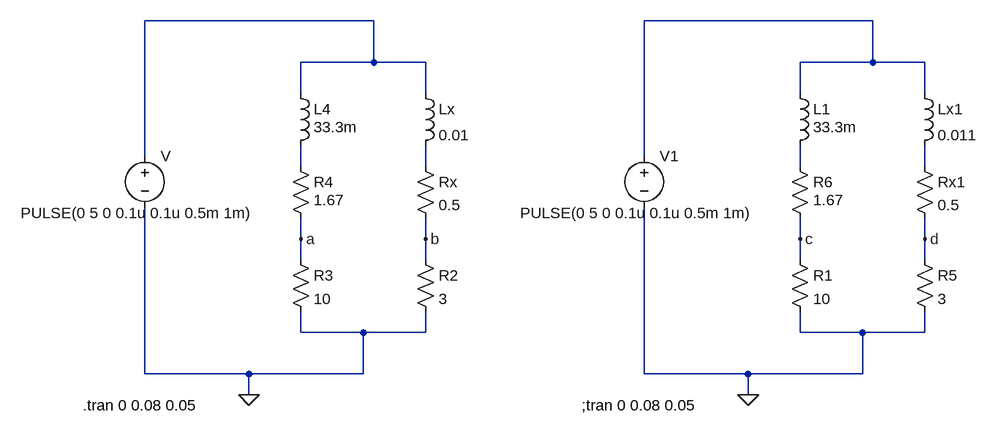
[diagram p0: schematic Maxwell_bridge.asc]
Maxwell_bridge.asc, the LTspice schematic file:
Version 4
SHEET 1 1288 680
WIRE 352 -64 0 -64
WIRE 1120 -64 768 -64
WIRE 352 0 352 -64
WIRE 352 0 240 0
WIRE 432 0 352 0
WIRE 1120 0 1120 -64
WIRE 1120 0 1008 0
WIRE 1200 0 1120 0
WIRE 240 48 240 0
WIRE 432 48 432 0
WIRE 1008 48 1008 0
WIRE 1200 48 1200 0
WIRE 0 144 0 -64
WIRE 768 144 768 -64
WIRE 240 160 240 128
WIRE 432 160 432 128
WIRE 1008 160 1008 128
WIRE 1200 160 1200 128
WIRE 240 272 240 240
WIRE 432 272 432 240
WIRE 1008 272 1008 240
WIRE 1200 272 1200 240
WIRE 240 304 240 272
WIRE 432 304 432 272
WIRE 1008 304 1008 272
WIRE 1200 304 1200 272
WIRE 240 416 240 384
WIRE 336 416 240 416
WIRE 432 416 432 384
WIRE 432 416 336 416
WIRE 1008 416 1008 384
WIRE 1104 416 1008 416
WIRE 1200 416 1200 384
WIRE 1200 416 1104 416
WIRE 0 480 0 224
WIRE 160 480 0 480
WIRE 336 480 336 416
WIRE 336 480 160 480
WIRE 768 480 768 224
WIRE 928 480 768 480
WIRE 1104 480 1104 416
WIRE 1104 480 928 480
WIRE 160 512 160 480
WIRE 928 512 928 480
FLAG 160 512 0
FLAG 240 272 a
FLAG 432 272 b
FLAG 928 512 0
FLAG 1008 272 c
FLAG 1200 272 d
SYMBOL voltage 0 128 R0
WINDOW 123 0 0 Left 0
WINDOW 39 0 0 Left 0
WINDOW 3 -191 104 Left 2
SYMATTR Value PULSE(0 5 0 0.1u 0.1u 0.5m 1m)
SYMATTR InstName V
SYMBOL res 224 288 R0
SYMATTR InstName R3
SYMATTR Value 10
SYMBOL res 416 288 R0
SYMATTR InstName R2
SYMATTR Value 3
SYMBOL ind 224 32 R0
WINDOW 3 36 68 Left 2
SYMATTR Value 33.3m
SYMATTR InstName L4
SYMBOL res 224 144 R0
WINDOW 3 36 68 Left 2
SYMATTR Value 1.67
SYMATTR InstName R4
SYMBOL ind 416 32 R0
SYMATTR InstName Lx
SYMATTR Value 0.01
SYMBOL res 416 144 R0
SYMATTR InstName Rx
SYMATTR Value 0.5
SYMBOL voltage 768 128 R0
WINDOW 123 0 0 Left 0
WINDOW 39 0 0 Left 0
WINDOW 3 -191 104 Left 2
SYMATTR Value PULSE(0 5 0 0.1u 0.1u 0.5m 1m)
SYMATTR InstName V1
SYMBOL res 992 288 R0
SYMATTR InstName R1
SYMATTR Value 10
SYMBOL res 1184 288 R0
SYMATTR InstName R5
SYMATTR Value 3
SYMBOL ind 992 32 R0
WINDOW 3 36 68 Left 2
SYMATTR Value 33.3m
SYMATTR InstName L1
SYMBOL res 992 144 R0
WINDOW 3 36 68 Left 2
SYMATTR Value 1.67
SYMATTR InstName R6
SYMBOL ind 1184 32 R0
SYMATTR InstName Lx1
SYMATTR Value 0.011
SYMBOL res 1184 144 R0
SYMATTR InstName Rx1
SYMATTR Value 0.5
TEXT -96 528 Left 2 !.tran 0 0.08 0.05
TEXT 672 528 Left 2 !;tran 0 0.08 0.05

The netlist it stands for:
* Maxwell_bridge.asc
V N001 0 PULSE(0 5 0 0.1u 0.1u 0.5m 1m)
R3 a 0 10
R2 b 0 3
L4 N001 N003 33.3m
R4 N003 a 1.67
Lx N001 N004 0.01
Rx N004 b 0.5
V1 N002 0 PULSE(0 5 0 0.1u 0.1u 0.5m 1m)
R1 c 0 10
R5 d 0 3
L1 N002 N005 33.3m
R6 N005 c 1.67
Lx1 N002 N006 0.011
Rx1 N006 d 0.5
.tran 0 0.08 0.05
;tran 0 0.08 0.05
.backanno
.end

* Results of the author's LTspice run, read from the files saved beside the schematic
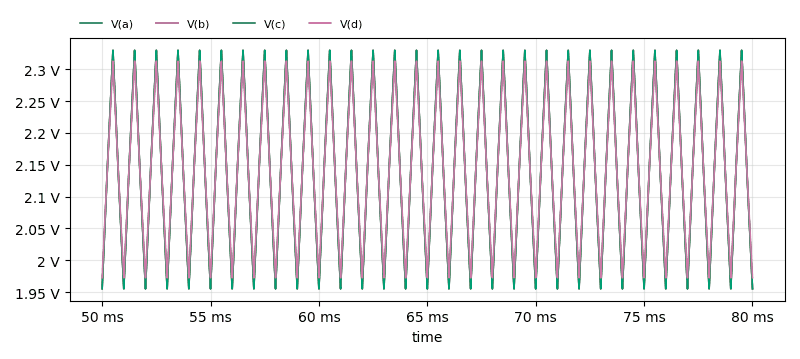
[diagram p1: Transient Analysis of Maxwell_bridge.asc, plotted from the saved traces]
* Transient Analysis, 1 run:
*   V(a): min 1.955 V, max 2.33 V, average 2.142 V, rms 2.147 V, last 1.955 V
*   V(b): min 1.956 V, max 2.33 V, average 2.143 V, rms 2.147 V, last 1.956 V
*   V(c): min 1.955 V, max 2.33 V, average 2.142 V, rms 2.147 V, last 1.955 V
*   V(d): min 1.973 V, max 2.313 V, average 2.143 V, rms 2.146 V, last 1.973 V